# Altium schematic sheet RGB_Logical_Shifter_Sheet.SchDoc
size A; SheetNumber: 4; SheetTotal: 7
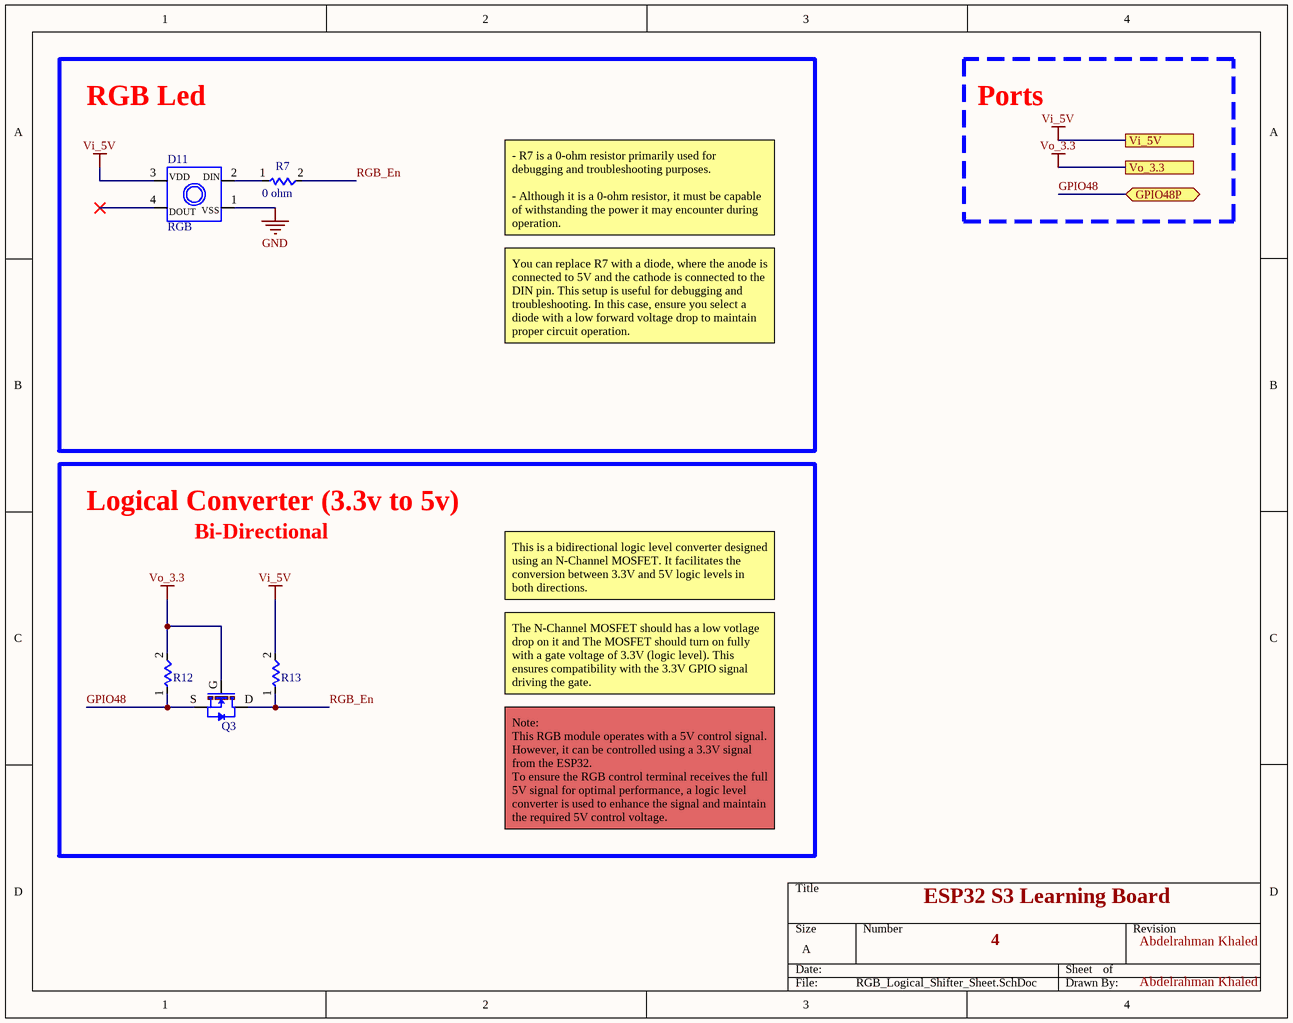
[diagram p0: RGB_Logical_Shifter_Sheet.SchDoc]

## Parts
D11  RGB  [RGB]
Q3  MOSFET_BSS138  [MOSFET_BSS138]  (value not drawn)
R7  0 ohm  [Resistor]
R12  10K ohm  [Resistor]  (value not drawn)
R13  10K ohm  [Resistor]  (value not drawn)

## Blocks framed on the sheet
RGB Led: D11 R7
Logical Converter (3.3v to 5v): Q3 R12 R13

## Ports
GPIO48P (bidir, see Block Diagram[3C], Microcontroller_ESP32_S3[4C]), Vi_5V (see Block Diagram[3C], LDO_Sheet[4B], Microcontroller_ESP32_S3[4D], USB_Communication_Sheet[4B], USB_UART_Converter[4A]), Vo_3.3 (see Block Diagram[3C], LDO_Sheet[4B], Microcontroller's_Prephirals_Sheet[4A], USB_UART_Converter[4A])

## Nets
GND: D11.1
Vi_5V: D11.3 R13.2(pin_2) ; port Vi_5V
Vo_3.3: Q3.G R12.2(pin_2) ; port Vo_3.3
GPIO48: Q3.S R12.1(Pin_1) ; port GPIO48P
RGB_En: Q3.D R7.2(pin_2) R13.1(Pin_1)
NetD11_2: D11.2 R7.1(Pin_1)

Not connected (* = marked no-connect by the designer): D11 4*

## Notes on the sheet
- Ports
- - R7 is a 0-ohm resistor primarily used for debugging and troubleshooting purposes.
  - Although it is a 0-ohm resistor, it must be capable of withstanding the power it may encounter during operation.
- You can replace R7 with a diode, where the anode is connected to 5V and the cathode is connected to the DIN pin. This setup is useful for debugging and troubleshooting. In this case, ensure you select a diode with a low forward voltage drop to maintain proper circuit operation.
- Bi-Directional
- This is a bidirectional logic level converter designed using an N-Channel MOSFET. It facilitates the conversion between 3.3V and 5V logic levels in both directions.
- The N-Channel MOSFET should has a low votlage drop on it and The MOSFET should turn on fully with a gate voltage of 3.3V (logic level). This ensures compatibility with the 3.3V GPIO signal driving the gate.
- Note:
  This RGB module operates with a 5V control signal. However, it can be controlled using a 3.3V signal from the ESP32.
  To ensure the RGB control terminal receives the full 5V signal for optimal performance, a logic level converter is used to enhance the signal and maintain the required 5V control voltage.
- ESP32 S3 Learning Board
- 4
- Abdelrahman Khaled
- (in symbol RGB) VDD; DIN; VSS; DOUT

## Library data of the parts
D11 = RGB: LED RGB CLEAR 3528 SMD
Q3 = MOSFET_BSS138: MOSFET N-CH 50V 220MA SOT23; Link: https://www.digikey.com/en/products/detail/micro-commercial-co/BSS138-TP/10054628
R7 R12 R13 = Resistance: Fuse Reseitance